# Altium schematic sheet sch_pwr.SchDoc
size A; SheetNumber: 2; SheetTotal: 3
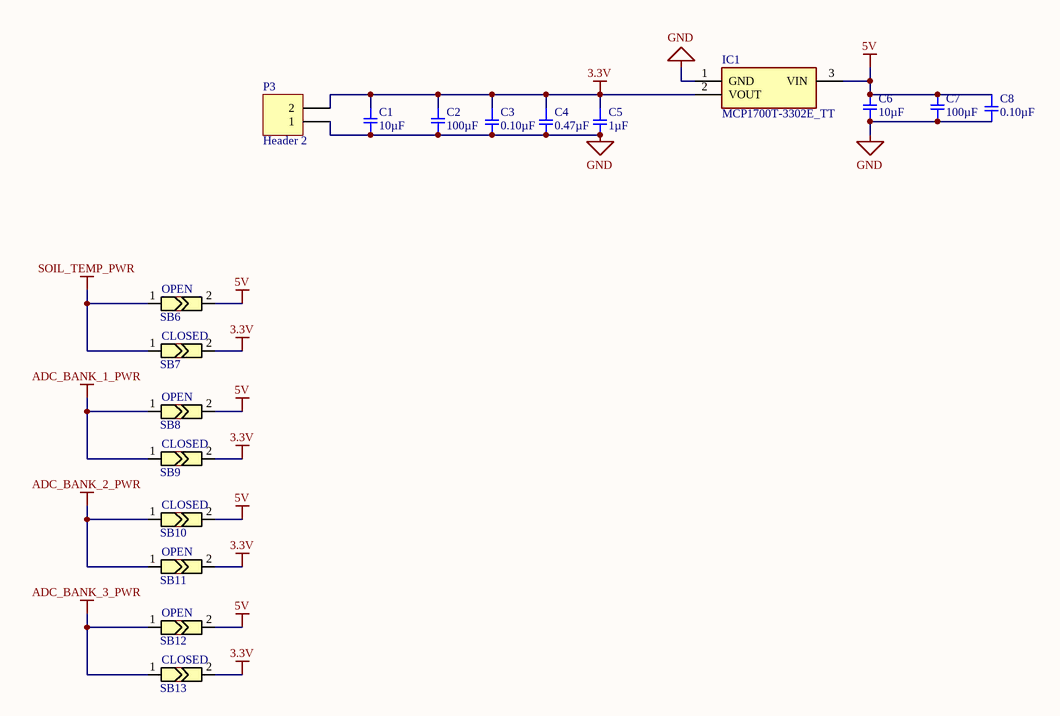
[diagram p0: sch_pwr.SchDoc]

## Parts
C1  10µF  [SMD-0805C]
C2  100µF  [SMD-0805C]
C3  0.10µF  [SMD-0402C]
C4  0.47µF  [SMD-0402C]
C5  1µF  [SMD-0402C]
C6  10µF  [SMD-0805C]
C7  100µF  [SMD-0805C]
C8  0.10µF  [SMD-0402C]
IC1  MCP1700T-3302E_TT  [SOT95P237X112-3N]
P3  Header 2  [HDR1X2]
SB6  SOLDER_JUMPER  [JUMPER_SMD]  (value not drawn)
SB7  SOLDER_JUMPER  [JUMPER_SMD]  (value not drawn)
SB8  SOLDER_JUMPER  [JUMPER_SMD]  (value not drawn)
SB9  SOLDER_JUMPER  [JUMPER_SMD]  (value not drawn)
SB10  SOLDER_JUMPER  [JUMPER_SMD]  (value not drawn)
SB11  SOLDER_JUMPER  [JUMPER_SMD]  (value not drawn)
SB12  SOLDER_JUMPER  [JUMPER_SMD]  (value not drawn)
SB13  SOLDER_JUMPER  [JUMPER_SMD]  (value not drawn)

## Nets
3.3V: C1.2 C2.2 C3.1 C4.1 C5.1 IC1.2(VOUT) P3.2 SB7.2 SB9.2 SB11.2 SB13.2
5V: C6.2 C7.2 C8.1 IC1.3(VIN) SB6.2 SB8.2 SB10.2 SB12.2
ADC_BANK_1_PWR: SB8.1 SB9.1
ADC_BANK_2_PWR: SB10.1 SB11.1
ADC_BANK_3_PWR: SB12.1 SB13.1
GND: C1.1 C2.1 C3.2 C4.2 C5.2 C6.1 C7.1 C8.2 IC1.1(GND) P3.1
SOIL_TEMP_PWR: SB6.1 SB7.1

## Notes on the sheet
- (near SB7) CLOSED
- (near SB6) OPEN
- (near SB8) OPEN
- (near SB9) CLOSED
- (near SB10) CLOSED
- (near SB11) OPEN
- (near SB12) OPEN
- (near SB13) CLOSED

## Library data of the parts
C1 C6 = GCJ21BR71H683KA01L: CAP CER 10UF 50V X7R 0805; Manufacturer: Murata Electronics North America; Factory Stock: 0; Unit Price (USD): 0.24; Minimum Quantity: 1; Tolerance: ±10%; Datasheets: http://www.murata.com/~/media/webrenewal/support/library/catalog/products/capacitor/mlcc/c03e.ashx; Image: //media.digikey.com/Renders/Murata%20Renders/0805%20(2012%20Metric)%20.85mm.jpg; Digi-Key Part Number: 490-5807-1-ND; Part Number: GCJ21BR71H683KA01L; Quantity Available: 4490; @ qty: 0; Packaging: Cut Tape (CT); Series: GCJ; Part Status: Active; Value: 10µF; Voltage: 50V; Temperature Coefficient: X7R; Operating Temperature: -55°C ~ 125°C; Features: Soft Termination; Ratings: AEC-Q200; Applications: Automotive, Boardflex Sensitive; Mounting Type: Surface Mount, MLCC; Package / Case: 0805 (2012 Metric); Size / Dimension: 0.079" L x 0.049" W (2.00mm x 1.25mm); Height - Seated (Max): -; Thickness (Max): 0.057" (1.45mm); Lead Spacing: -; Lead Style: -
C2 C7 = GCJ21BR71H683KA01L: CAP CER 100UF 50V X7R 0805; Manufacturer: Murata Electronics North America; Factory Stock: 0; Unit Price (USD): 0.24; Minimum Quantity: 1; Tolerance: ±10%; Datasheets: http://www.murata.com/~/media/webrenewal/support/library/catalog/products/capacitor/mlcc/c03e.ashx; Image: //media.digikey.com/Renders/Murata%20Renders/0805%20(2012%20Metric)%20.85mm.jpg; Digi-Key Part Number: 490-5807-1-ND; Part Number: GCJ21BR71H683KA01L; Quantity Available: 4490; @ qty: 0; Packaging: Cut Tape (CT); Series: GCJ; Part Status: Active; Value: 100µF; Voltage: 50V; Temperature Coefficient: X7R; Operating Temperature: -55°C ~ 125°C; Features: Soft Termination; Ratings: AEC-Q200; Applications: Automotive, Boardflex Sensitive; Mounting Type: Surface Mount, MLCC; Package / Case: 0805 (2012 Metric); Size / Dimension: 0.079" L x 0.049" W (2.00mm x 1.25mm); Height - Seated (Max): -; Thickness (Max): 0.057" (1.45mm); Lead Spacing: -; Lead Style: -
C3 C8 = GCM155R71C104KA55D: CAP CER 0.1UF 16V X7R 0402; Manufacturer: Murata Electronics North America; Factory Stock: 0; Unit Price (USD): 0.1; Minimum Quantity: 1; Tolerance: ±10%; Datasheets: http://www.murata.com/~/media/webrenewal/support/library/catalog/products/capacitor/mlcc/c03e.ashx; Image: //media.digikey.com/Renders/Murata%20Renders/ZRB-SERIES-0402.jpg; Digi-Key Part Number: 490-4759-1-ND; Part Number: GCM155R71C104KA55D; Quantity Available: 734194; @ qty: 0; Packaging: Cut Tape (CT); Series: GCM; Part Status: Active; Value: 0.10µF; Voltage: 16V; Temperature Coefficient: X7R; Operating Temperature: -55°C ~ 125°C; Features: -; Ratings: AEC-Q200; Applications: Automotive; Mounting Type: Surface Mount, MLCC; Package / Case: 0402 (1005 Metric); Size / Dimension: 0.039" L x 0.020" W (1.00mm x 0.50mm); Height - Seated (Max): -; Thickness (Max): 0.022" (0.55mm); Lead Spacing: -; Lead Style: -
C4 = GCM155R71C104KA55D: CAP CER 0.47UF 16V X7R 0402; Manufacturer: Murata Electronics North America; Factory Stock: 0; Unit Price (USD): 0.1; Minimum Quantity: 1; Tolerance: ±10%; Datasheets: http://www.murata.com/~/media/webrenewal/support/library/catalog/products/capacitor/mlcc/c03e.ashx; Image: //media.digikey.com/Renders/Murata%20Renders/ZRB-SERIES-0402.jpg; Digi-Key Part Number: 490-4759-1-ND; Part Number: GCM155R71C104KA55D; Quantity Available: 734194; @ qty: 0; Packaging: Cut Tape (CT); Series: GCM; Part Status: Active; Value: 0.47µF; Voltage: 16V; Temperature Coefficient: X7R; Operating Temperature: -55°C ~ 125°C; Features: -; Ratings: AEC-Q200; Applications: Automotive; Mounting Type: Surface Mount, MLCC; Package / Case: 0402 (1005 Metric); Size / Dimension: 0.039" L x 0.020" W (1.00mm x 0.50mm); Height - Seated (Max): -; Thickness (Max): 0.022" (0.55mm); Lead Spacing: -; Lead Style: -
C5 = GCM155R71C104KA55D: CAP CER 1UF 16V X7R 0402; Manufacturer: Murata Electronics North America; Factory Stock: 0; Unit Price (USD): 0.1; Minimum Quantity: 1; Tolerance: ±10%; Datasheets: http://www.murata.com/~/media/webrenewal/support/library/catalog/products/capacitor/mlcc/c03e.ashx; Image: //media.digikey.com/Renders/Murata%20Renders/ZRB-SERIES-0402.jpg; Digi-Key Part Number: 490-4759-1-ND; Part Number: GCM155R71C104KA55D; Quantity Available: 734194; @ qty: 0; Packaging: Cut Tape (CT); Series: GCM; Part Status: Active; Value: 1µF; Voltage: 16V; Temperature Coefficient: X7R; Operating Temperature: -55°C ~ 125°C; Features: -; Ratings: AEC-Q200; Applications: Automotive; Mounting Type: Surface Mount, MLCC; Package / Case: 0402 (1005 Metric); Size / Dimension: 0.039" L x 0.020" W (1.00mm x 0.50mm); Height - Seated (Max): -; Thickness (Max): 0.022" (0.55mm); Lead Spacing: -; Lead Style: -
IC1 = MCP1700T-3302E_TT: Integrated Circuit; Manufacturer_Name: Microchip; Manufacturer_Part_Number: MCP1700T-3302E/TT; Datasheet Link: http://docs-emea.rs-online.com/webdocs/0dd1/0900766b80dd189b.pdf; Height: 1.12mm; Arrow Part Number: MCP1700T-3302E/TT; Arrow Price/Stock: https://www.arrow.com/en/products/mcp1700t-3302ett/microchip-technology; Mouser Part Number: 579-MCP1700T3302E/TT; Mouser Price/Stock: https://www.mouser.co.uk/ProductDetail/Microchip-Technology/MCP1700T-3302E-TT?qs=fM4xO01eazPmCNDrdHEdaw%3D%3D
P3 = Header 2: Header, 2-Pin; LatestRevisionDate: 17-Jul-2002; LatestRevisionNote: Re-released for DXP Platform.; Publisher: Altium Limited